# Altium schematic sheet Main.SchDoc
size 209 x 297 mm; PartName: Датчик учета товара; Date: 03.03.2017; Author: Мурашкин Д.В.; CompanyName: Smart Shelf Eurasia; DrawnBy: Мурашкин Д.В.; Address1: Address1; Address2: Address2; Address3: Address3; Address4: Address4; DocumentNumber: SS19946-COSHP-R03-01; SheetNumber: 1; SheetTotal: 3; Scale: -; Letter1Column: Э; CurrentDate: 03.03.2017
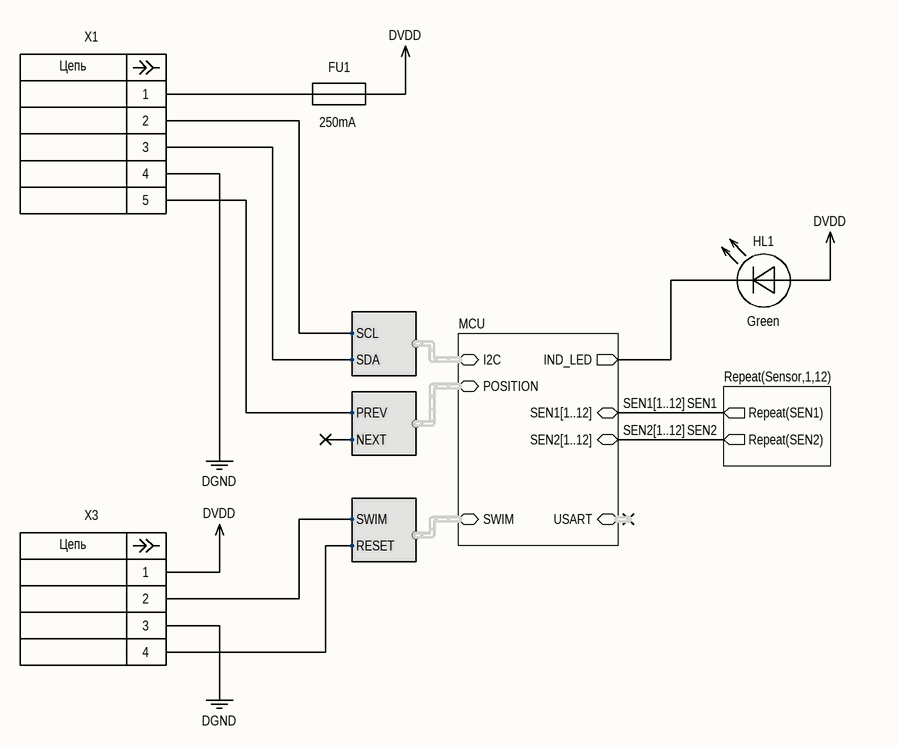
[diagram p0: Main.SchDoc]

## Parts
FU1  250mA  [FUSE3216N]
HL1  Green  [LED 2012N]
X1  B5B-XH-A  [B5B-XH-A]  (value not drawn)
X3  ST SWIM connector  [ST SWIM connector]  (value not drawn)  (no BOM)

## Sub-sheets
MCU = MCU.SchDoc: SEN1[1..12] (bidir), SWIM (harness SWIM), IND_LED (out), I2C (harness I2C), USART (harness USART), POSITION (harness POSITION), SEN2[1..12] (bidir)
Repeat(Sensor,1,12) = Sensor.SchDoc: Repeat(SEN1) (out), Repeat(SEN2) (out)

## Harnesses
I2C: SDA, SCL
SWIM: SWIM, RESET
POSITION: NEXT, PREV

## Nets
DGND: X1.4 X3.3
DVDD: FU1.2 HL1.1(Anode) X3.1
SEN1: sheet Repeat(Sensor,1,12)/Repeat(SEN1)
SEN2: sheet Repeat(Sensor,1,12)/Repeat(SEN2)
NetFU1_1: FU1.1 X1.1
NetHL1_2: HL1.2(Cathode) ; sheet MCU/IND_LED
NetX1_2: X1.2 ; sheet MCU/I2C.SCL
NetX1_3: X1.3 ; sheet MCU/I2C.SDA
NetX1_5: X1.5 ; sheet MCU/POSITION.PREV
NetX3_2: X3.2 ; sheet MCU/SWIM.SWIM
NetX3_4: X3.4 ; sheet MCU/SWIM.RESET

## Buses and harness runs
bus SEN1[1..12] = sheet MCU/SEN1[1..12]
bus SEN2[1..12] = sheet MCU/SEN2[1..12]

## Notes on the sheet
- Перв. примен.
- Справ. №
- Подп. и дата
- Инв. № дубл.
- Взам. инв. №
- Разраб.
- Изм.
- Лист
- № докум.
- Подп.
- Дата
- Лит.
- Масса
- Масштаб
- Пров.
- Т.контр.
- Листов
- Инв. № подл.
- Утв.
- Н.контр.
- 2.106-A4
- Копировал
- Формат А4
- (in symbol B5B-XH-A) Цепь
- (in symbol ST SWIM connector) Цепь

## Library data of the parts
FU1 = 0ZCJ0025AF2E: PTC Resettable Fuse 250mA; Manufacturer: Bel; Group: Fuses; Short description: PTC RESTTBLE 0.25A 24V CHIP 1206; Part name: 0ZCJ0025AF2E; Package: 3216; Distributor: Digi-Key; Value: 250mA
HL1 = LED 2012: LED; Manufacturer: OSRAM Opto Semiconductors Inc.; Part name: LG R971-KN-1; Group: LED Indication; Short description: LED GREEN DIFFUSED 0805 SMD; Package: 2012; Distributor: Digi-Key; Color: Green
X1 = B5B-XH-A: Header, 2.54, 5p, Top; Manufacturer: JST Sales America Inc; Part name: B5B-XH-A(LF)(SN); Group: Rectangular Connectors - Headers, Male Pins; Short description: CONN HEADER XH TOP 5POS 2.5MM; Package: 5 DIP 2.54; Distributor: Digi-Key
X3 = ST SWIM connector: Debug SWIM Pads; Manufacturer: ST Microelectronics; Group: Connectors; Package: 4 DIP 2.54; Distributor: ST Microelectronics